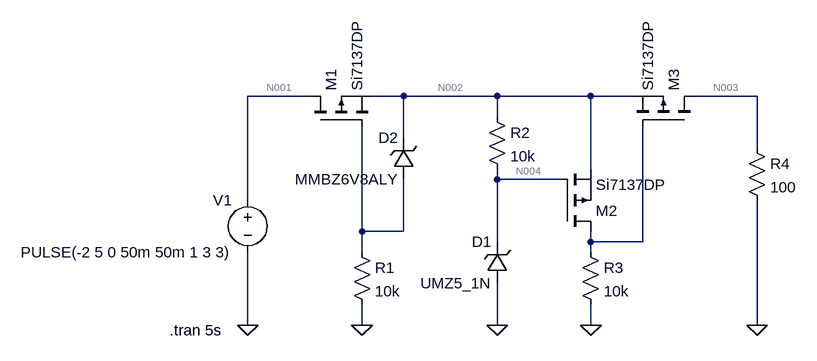
[diagram p0: schematic ReserveOverVoltageProtection.asc]
ReserveOverVoltageProtection.asc, the LTspice schematic file:
Version 4
SHEET 1 1444 680
WIRE 688 -48 592 -48
WIRE 832 -48 784 -48
WIRE 976 -48 832 -48
WIRE 1120 -48 976 -48
WIRE 1184 -48 1120 -48
WIRE 1376 -48 1280 -48
WIRE 976 -16 976 -48
WIRE 832 16 832 -48
WIRE 1376 32 1376 -48
WIRE 1120 64 1120 -48
WIRE 976 80 976 64
WIRE 1072 80 976 80
WIRE 592 112 592 -48
WIRE 768 160 768 0
WIRE 832 160 832 80
WIRE 832 160 768 160
WIRE 976 176 976 80
WIRE 1120 176 1120 160
WIRE 1200 176 1200 0
WIRE 1200 176 1120 176
WIRE 768 192 768 160
WIRE 1120 192 1120 176
WIRE 592 304 592 192
WIRE 768 304 768 272
WIRE 976 304 976 240
WIRE 1120 304 1120 272
WIRE 1376 304 1376 112
FLAG 592 304 0
FLAG 976 304 0
FLAG 768 304 0
FLAG 1376 304 0
FLAG 1120 304 0
SYMBOL voltage 592 96 M0
WINDOW 123 0 0 Left 0
WINDOW 39 0 0 Left 0
SYMATTR InstName V1
SYMATTR Value PULSE(-2 5 0 50m 50m 1 3 3)
SYMBOL zener 992 240 R180
WINDOW 0 24 64 Left 2
WINDOW 3 24 0 Left 2
SYMATTR InstName D1
SYMATTR Value UMZ5_1N
SYMBOL res 752 176 R0
SYMATTR InstName R1
SYMATTR Value 10k
SYMBOL res 960 -32 R0
SYMATTR InstName R2
SYMATTR Value 10k
SYMBOL zener 848 80 R180
WINDOW 0 24 64 Left 2
WINDOW 3 24 0 Left 2
SYMATTR InstName D2
SYMATTR Value MMBZ6V8ALY
SYMBOL pmos 688 0 R270
SYMATTR InstName M1
SYMATTR Value Si7137DP
SYMBOL pmos 1072 160 M180
SYMATTR InstName M2
SYMATTR Value Si7137DP
SYMBOL pmos 1280 0 M270
SYMATTR InstName M3
SYMATTR Value Si7137DP
SYMBOL res 1104 176 R0
SYMATTR InstName R3
SYMATTR Value 10k
SYMBOL res 1360 16 R0
SYMATTR InstName R4
SYMATTR Value 100
TEXT 472 312 Left 2 !.tran 5s

The netlist it stands for:
* ReserveOverVoltageProtection.asc
V1 N001 0 PULSE(-2 5 0 50m 50m 1 3 3)
D1 0 N004 UMZ5_1N
R1 N005 0 10k
R2 N002 N004 10k
D2 N005 N002 MMBZ6V8ALY
M1 N001 N005 N002 N002 Si7137DP
M2 N006 N004 N002 N002 Si7137DP
M3 N003 N006 N002 N002 Si7137DP
R3 N006 0 10k
R4 N003 0 100
.model D D
.lib standard.dio
.model NMOS NMOS
.model PMOS PMOS
.lib standard.mos
.tran 5s
.backanno
.end

* Results of the author's LTspice run, read from the files saved beside the schematic
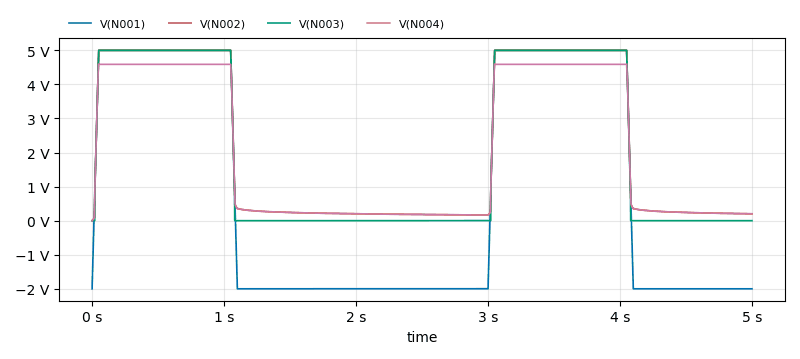
[diagram p1: Transient Analysis of ReserveOverVoltageProtection.asc, plotted from the saved traces]
* Transient Analysis, 1 run:
*   V(N001): min -2 V, max 5 V, average 940 mV, rms 3.535 V, last -2 V
*   V(N002): min -1.451 mV, max 5 V, average 2.199 V, rms 3.204 V, last 201.9 mV
*   V(N003): min 0 V, max 5 V, average 2.069 V, rms 3.199 V, last 0 V
*   V(N004): min -1.451 mV, max 4.599 V, average 2.034 V, rms 2.947 V, last 201.9 mV